# EAGLE schematic shiitakevm (EAGLE 8.2.1)
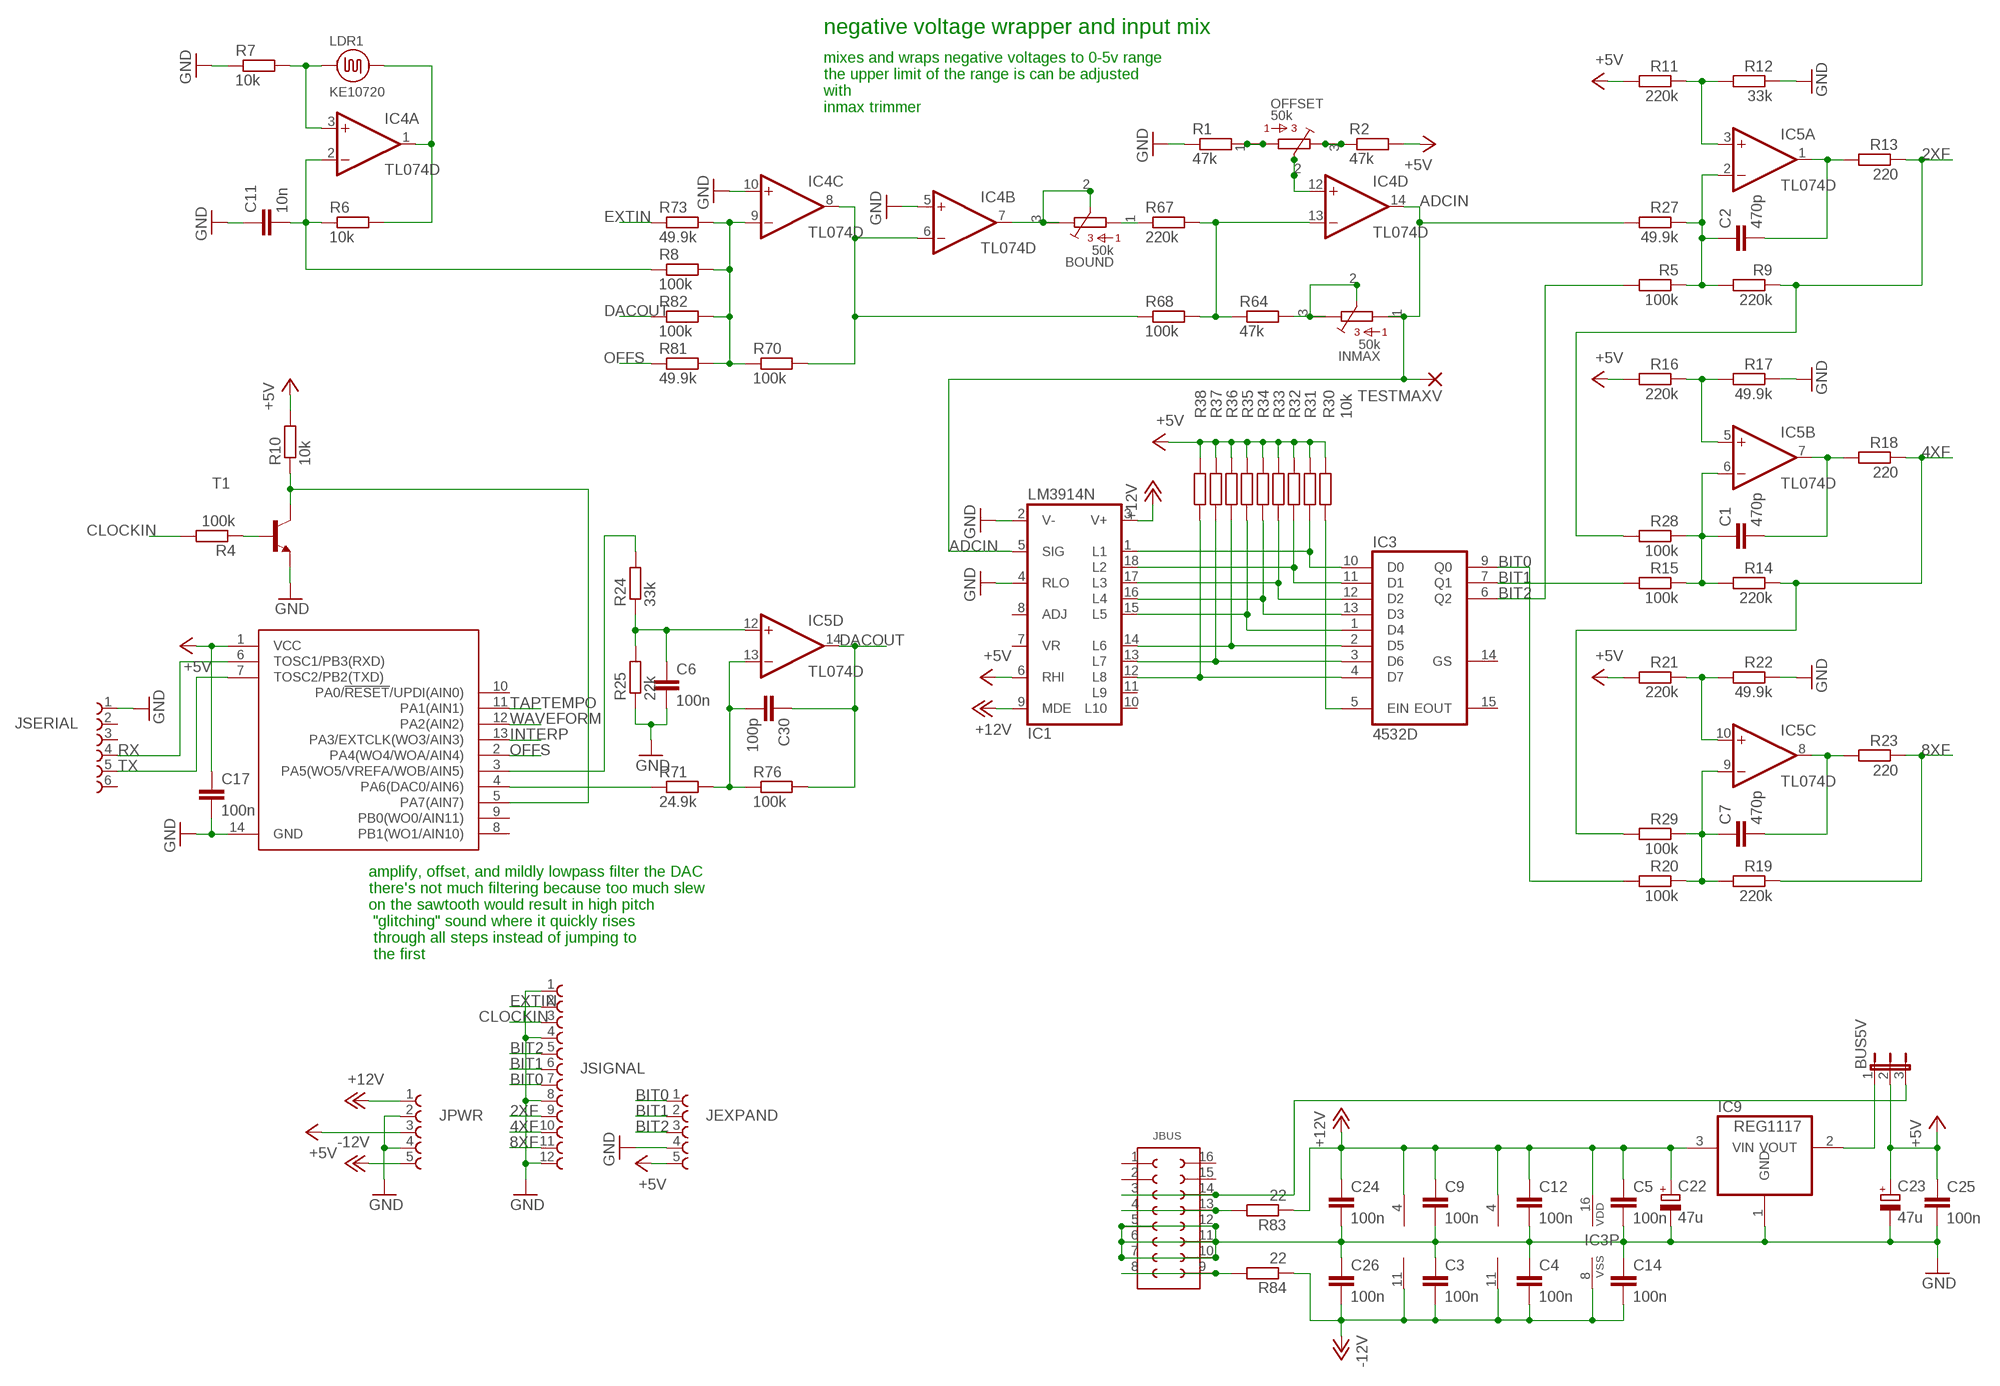
[diagram p0: schematic, sheet 1]

## Parts
BOUND  50k  3386  [3386-MULTI]
BUS5V  JP2E  [JP2]
C1  470p  C-EUC1206  [C1206]
C2  470p  C-EUC1206  [C1206]
C3  100n  C-EUC1206  [C1206]
C4  100n  C-EUC1206  [C1206]
C5  100n  C-EUC1206  [C1206]
C6  100n  C-EUC1206  [C1206]
C7  470p  C-EUC1206  [C1206]
C9  100n  C-EUC1206  [C1206]
C11  10n  C-EUC1206  [C1206]
C12  100n  C-EUC1206  [C1206]
C14  100n  C-EUC1206  [C1206]
C17  100n  C-EUC1206  [C1206]
C22  47u  CPOL-EUB  [PANASONIC_B]
C23  47u  CPOL-EUB  [PANASONIC_B]
C24  100n  C-EUC1206  [C1206]
C25  100n  C-EUC1206  [C1206]
C26  100n  C-EUC1206  [C1206]
C30  100p  C-EUC1206  [C1206]
IC1  LM3914N  [DIL18]
IC3  4532D  [SO16]
IC4  TL074D  [SO14]
IC5  TL074D  [SO14]
IC9  REG1117  [SOT223]
IC11  ATTINY1614-SSNR  [SO14]
INMAX  50k  3386  [3386-MULTI]
JBUS  61301621121  [61301621121]
JEXPAND  61300511121  [61300511121]
JPWR  61300511121  [61300511121]
JSERIAL  61300611821  [61300611821]
JSIGNAL  61301211121  [61301211121]
LDR1  KE10720  LDR  [LDR]
OFFSET  50k  3386  [3386-MULTI]
R1  47k  R-EU_R1206  [R1206]
R2  47k  R-EU_R1206  [R1206]
R4  100k  R-EU_R1206  [R1206]
R5  100k  R-EU_R1206  [R1206]
R6  10k  R-EU_R1206  [R1206]
R7  10k  R-EU_R1206  [R1206]
R8  100k  R-EU_R1206  [R1206]
R9  220k  R-EU_R1206  [R1206]
R10  10k  R-EU_R1206  [R1206]
R11  220k  R-EU_R1206  [R1206]
R12  33k  R-EU_R1206  [R1206]
R13  220  R-EU_R1206  [R1206]
R14  220k  R-EU_R1206  [R1206]
R15  100k  R-EU_R1206  [R1206]
R16  220k  R-EU_R1206  [R1206]
R17  49.9k  R-EU_R1206  [R1206]
R18  220  R-EU_R1206  [R1206]
R19  220k  R-EU_R1206  [R1206]
R20  100k  R-EU_R1206  [R1206]
R21  220k  R-EU_R1206  [R1206]
R22  49.9k  R-EU_R1206  [R1206]
R23  220  R-EU_R1206  [R1206]
R24  33k  R-EU_R1206  [R1206]
R25  22k  R-EU_R1206  [R1206]
R27  49.9k  R-EU_R1206  [R1206]
R28  100k  R-EU_R1206  [R1206]
R29  100k  R-EU_R1206  [R1206]
R30  10k  R-EU_R1206  [R1206]
R31  10k  R-EU_R1206  [R1206]
R32  10k  R-EU_R1206  [R1206]
R33  10k  R-EU_R1206  [R1206]
R34  10k  R-EU_R1206  [R1206]
R35  10k  R-EU_R1206  [R1206]
R36  10k  R-EU_R1206  [R1206]
R37  10k  R-EU_R1206  [R1206]
R38  10k  R-EU_R1206  [R1206]
R64  47k  R-EU_R1206  [R1206]
R67  220k  R-EU_R1206  [R1206]
R68  100k  R-EU_R1206  [R1206]
R70  100k  R-EU_R1206  [R1206]
R71  24.9k  R-EU_R1206  [R1206]
R73  49.9k  R-EU_R1206  [R1206]
R76  100k  R-EU_R1206  [R1206]
R81  49.9k  R-EU_R1206  [R1206]
R82  100k  R-EU_R1206  [R1206]
R83  22  R-EU_R1206  [R1206]
R84  22  R-EU_R1206  [R1206]
T1  MMBT3904LT1-NPN-SOT23-BEC  [SOT23-BEC]
TESTMAXV  2,0/0,9-S  [2,0/0,9-S]

## Nets
2XF: JSIGNAL.9 R9.1 R13.1 R28.2
4XF: JSIGNAL.10 R14.1 R18.1 R29.2
8XF: JSIGNAL.11 R19.1 R23.1
+5V: BUS5V.2 C17.1 C23.+ C25.1 IC1.6(RHI) IC11.1(VCC) JEXPAND.5 JPWR.3 R2.2 R10.2 R11.2 R16.2 R21.2 R30.1 R31.2 R32.2 R33.2 R34.2 R35.2 R36.2 R37.2 R38.2
+12V: C5.1 C9.1 C12.1 C22.+ C24.1 IC1.3(V+) IC1.9(MDE) IC3.16(VDD) IC4.4(P:V+) IC5.4(P:V+) IC9.3(VIN) JPWR.1 R83.1
-12V: C3.2 C4.2 C14.2 C26.2 IC3.8(VSS) IC4.11(P:V-) IC5.11(P:V-) JPWR.5 R84.1
ADCIN: IC1.5(SIG) IC4.14(D:OUT) INMAX.1 INMAX.4 R27.2 TESTMAXV.1(P)
BIT0: IC3.9(Q0) JEXPAND.1 JSIGNAL.7 R20.2
BIT1: IC3.7(Q1) JEXPAND.2 JSIGNAL.6 R15.2
BIT2: IC3.6(Q2) JEXPAND.3 JSIGNAL.5 R5.2
CLOCKIN: JSIGNAL.3 R4.2
DACOUT: C30.1 IC5.14(D:OUT) R76.2 R82.1
EXTIN: JSIGNAL.2 R73.1
GND: C3.1 C4.1 C5.2 C6.2 C9.2 C11.1 C12.2 C14.1 C17.2 C22.- C23.- C24.2 C25.2 C26.1 IC1.2(V-) IC1.4(RLO) IC4.5(B:+IN) IC4.10(C:+IN) IC9.1(GND) IC11.14(GND) JBUS.5 JBUS.6 JBUS.7 JBUS.10 JBUS.11 JBUS.12 JEXPAND.4 JPWR.2 JPWR.4 JSERIAL.1 JSIGNAL.1 JSIGNAL.4 JSIGNAL.8 JSIGNAL.12 R1.1 R7.1 R12.1 R17.1 R22.1 R25.1 T1.E
INTERP: IC11.13(PA3/EXTCLK(WO3/AIN3))
N$: C2.2 IC5.1(A:OUT) R13.2
N$1: IC1.15(L5) IC3.1(D4) R35.1
N$2: IC1.16(L4) IC3.13(D3) R34.1
N$3: IC1.17(L3) IC3.12(D2) R33.1
N$4: IC1.18(L2) IC3.11(D1) R32.1
N$5: IC1.1(L1) IC3.10(D0) R31.1
N$6: IC3.5(EIN) R30.2
N$7: IC4.9(C:-IN) R8.2 R70.1 R73.2 R81.2 R82.2
N$8: OFFSET.3 OFFSET.6 R2.1
N$9: OFFSET.1 OFFSET.4 R1.2
N$10: IC4.12(D:+IN) OFFSET.2 OFFSET.5
N$12: BOUND.1 BOUND.4 R67.1
N$13: IC5.3(A:+IN) R11.1 R12.2
N$15: JBUS.4 JBUS.13 R83.2
N$16: R4.1 T1.B
N$17: C11.2 IC4.2(A:-IN) R6.1 R8.1
N$18: IC4.3(A:+IN) LDR1.P$1 R7.2
N$19: IC11.5(PA7(AIN7)) R10.1 T1.C
N$20: IC4.1(A:OUT) LDR1.P$2 R6.2
N$21: C2.1 IC5.2(A:-IN) R5.1 R9.2 R27.1
N$22: IC5.5(B:+IN) R16.1 R17.2
N$23: C1.1 IC5.6(B:-IN) R14.2 R15.1 R28.1
N$24: C1.2 IC5.7(B:OUT) R18.2
N$25: IC5.10(C:+IN) R21.1 R22.2
N$26: C7.1 IC5.9(C:-IN) R19.2 R20.1 R29.1
N$27: C7.2 IC5.8(C:OUT) R23.2
N$28: C6.1 IC5.12(D:+IN) R24.1 R25.2
N$29: IC11.3(PA5(WO5/VREFA/WOB/AIN5)) R24.2
N$33: IC1.14(L6) IC3.2(D5) R36.1
N$34: IC1.13(L7) IC3.3(D6) R37.1
N$35: IC1.12(L8) IC3.4(D7) R38.1
N$46: JBUS.8 JBUS.9 R84.2
N$50: BOUND.2 BOUND.3 BOUND.5 BOUND.6 IC4.7(B:OUT)
N$51: BUS5V.3 JBUS.3 JBUS.14
N$52: INMAX.2 INMAX.3 INMAX.5 INMAX.6 R64.2
N$54: IC4.13(D:-IN) R64.1 R67.2 R68.2
N$55: IC4.6(B:-IN) IC4.8(C:OUT) R68.1 R70.2
N$56: IC11.4(PA6(DAC0/AIN6)) R71.1
N$61: C30.2 IC5.13(D:-IN) R71.2 R76.1
N$64: BUS5V.1 IC9.2(VOUT)
OFFS: IC11.2(PA4(WO4/WOA/AIN4)) R81.1
RX: IC11.6(TOSC1/PB3(RXD)) JSERIAL.4
TAPTEMPO: IC11.11(PA1(AIN1))
TX: IC11.7(TOSC2/PB2(TXD)) JSERIAL.5
WAVEFORM: IC11.12(PA2(AIN2))
Unconnected: IC1.7(VR) IC1.8(ADJ) IC1.10(L10) IC1.11(L9) IC3.14(GS) IC3.15(EOUT) IC11.8(PB1(WO1/AIN10)) IC11.9(PB0(WO0/AIN11)) IC11.10(PA0/!RESET!/UPDI(AIN0)) JBUS.1 JBUS.2 JBUS.15 JBUS.16 JSERIAL.2 JSERIAL.3 JSERIAL.6

## Notes on the sheet
- negative voltage wrapper and input mix
- mixes and wraps negative voltages to 0-5v range
  the upper limit of the range is can be adjusted
  with 
  inmax trimmer
- amplify, offset, and mildly lowpass filter the DAC
  there's not much filtering because too much slew 
  on the sawtooth would result in high pitch
   "glitching" sound where it quickly rises
   through all steps instead of jumping to
   the first

## Library data of the parts
BOUND INMAX OFFSET = bourns:3386: 3386 Series 3/8" Square Trimmer (Multi-Package F,P,K & Y)
BUS5V = jumper:JP2E: JUMPER
C1-C7 C9 C11 C12 C14 C17 C24-C26 C30 = resistor:C-EU: CAPACITOR, European symbol
C22 C23 = resistor:CPOL-EU: POLARIZED CAPACITOR, European symbol
IC1 = linear:LM3914N: LED DRIVER senses analog voltage levels and drives 10 LEDs
IC3 = 45xx:4532: 8-bit PRIORITY ENCODER
IC4 IC5 = linear:TL074: OP AMP
IC9 = og-vreg:REG1117: 800mA and 1A Low Dropout (LDO) Positive Regulator 1.8V, 2.5V, 2.85V, 3.3V, 5V, and Adj
IC11 = stuaiff:ATTINY1614-SSNR
JBUS = Wurth_Elektronik_Electromechanic_Board_to_Board_Connectors_rev17a:61301621121: WR-PHD 2.54mm Dual Pin Header, 16 Pins =>Code : Con_BTB_PHD_2.54_2_61301621121 <http://katalog.we-online.de/media/images/eican/Con_BTB_PHD_2.54_2_6130xx21121_pf2.jpg> Details see: http://katalog.we-online.de/en/em/613_0xx_211_21 Created 2014-05-29, Karrer Zheng 2014 (C) Würth Elektronik
JEXPAND JPWR = Board-to-Board (rev17e):61300511121: WR-PHD 2.54mm Pin Header, 5 Pin =>Code : Con_BTB_PHD_2.54_1_THT_61300511121 <http://katalog.we-online.de/media/images/eican/Con_BTB_PHD_2.54_1_THT_6130xx11121_pf2.jpg> Details see: http://katalog.we-online.de/en/em/613_0xx_111_21 Created 2014-05-29, Karrer Zheng 2014 (C) Würth Elektronik
JSERIAL = Wurth_Elektronik_Electromechanic_Board_to_Board_Connectors_rev17a:61300611821: WR-PHD 2.54mm Socket Header, 6 Pins =>Code : Con_BTB_SHD_2.54_1_THT_61300611821 <http://katalog.we-online.de/media/images/eican/Con_BTB_SHD_2.54_1_THT_6130xx11821_pf2.jpg> Details see: http://katalog.we-online.de/en/em/613_0xx_118_21 Created 2014-05-29, Karrer Zheng 2014 (C) Würth Elektronik
JSIGNAL = Board-to-Board (rev17e):61301211121: WR-PHD 2.54mm Pin Header, 12 Pins =>Code : Con_BTB_PHD_2.54_1_THT_61301211121 <http://katalog.we-online.de/media/images/eican/Con_BTB_PHD_2.54_1_THT_6130xx11121_pf2.jpg> Details see: http://katalog.we-online.de/en/em/613_0xx_111_21 Created 2014-05-29, Karrer Zheng 2014 (C) Würth Elektronik
LDR1 = stuaiff:LDR
R1 R2 R4-R25 R27-R38 R64 R67 R68 R70 R71 R73 R76 R81-R84 = resistor:R-EU_: RESISTOR, European symbol
T1 = transistor:*-NPN-: NPN Transistror BF959 corrected 2008.03.06
TESTMAXV = synthdiy updated imperial:2,0/0,9-S: SQUARE THROUGH-HOLE PAD 2.0 mm, 0.9 mm/0.079",0.035"